# EasyEDA Pro project ProDocument_PCB1_2024-02-11.epro

# Board PCB1
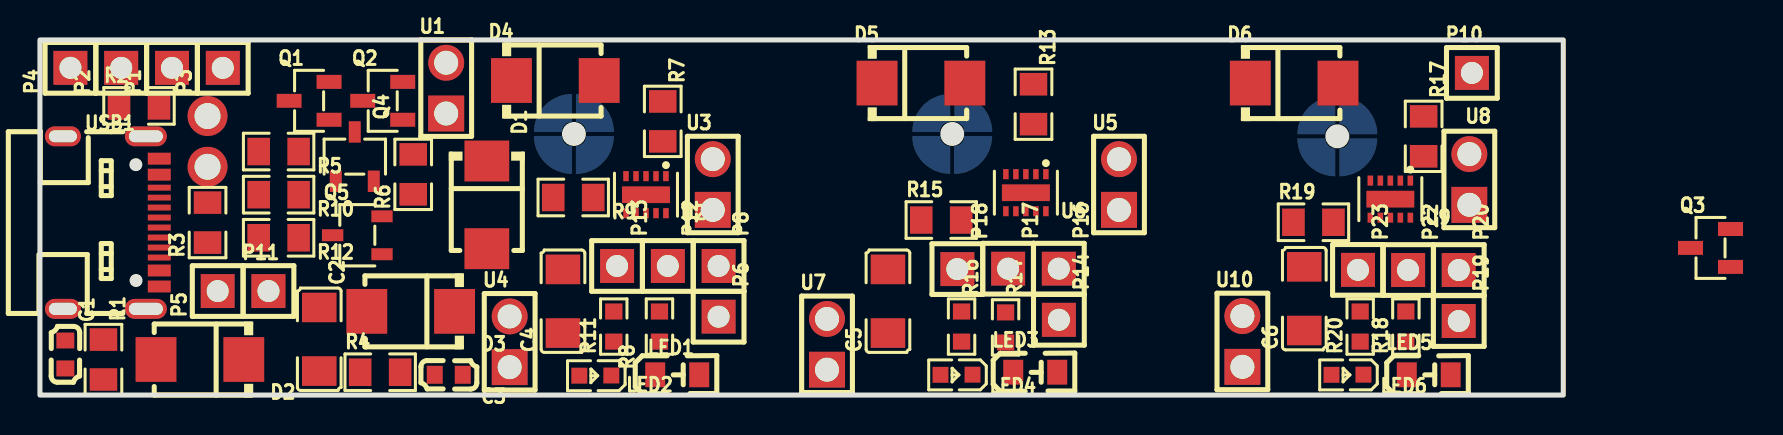
[diagram p0: board, top side]
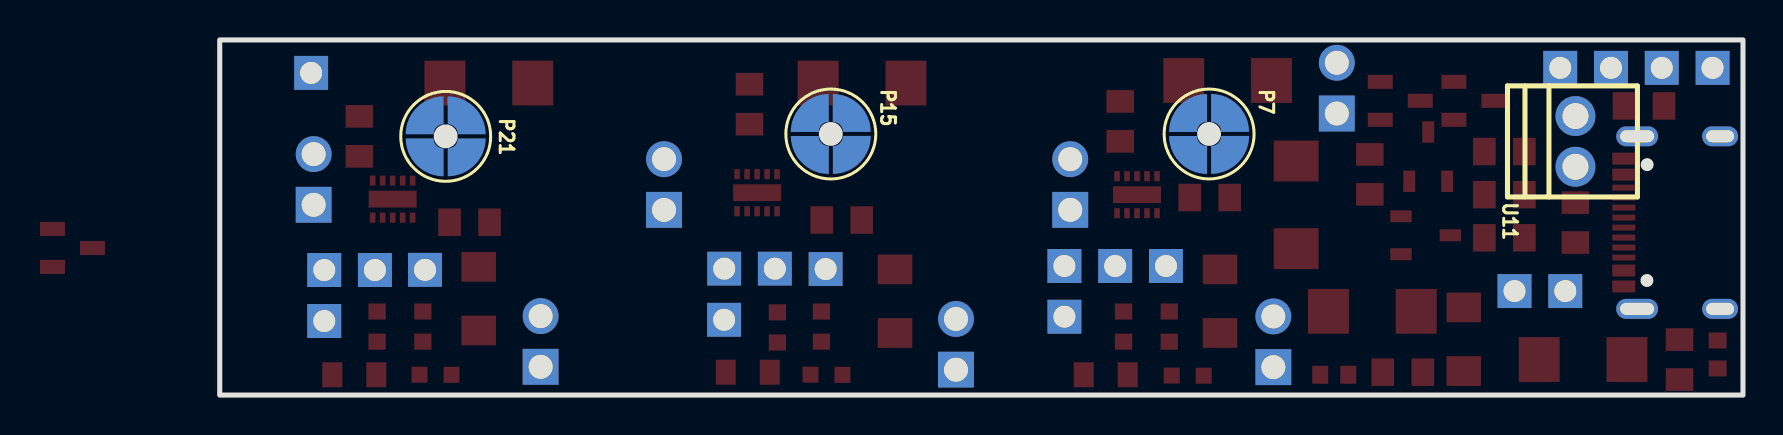
[diagram p1: board, bottom side, seen from below]

Outline 76.2 x 17.78 mm; copper layers: Top Layer, Bottom Layer. Coordinates in mm from the lower left corner of the outline.
Outline path: rectangle 0,17.78 76.2,0
Stack: Top Layer 0.035mm / Dielectric1 1.51mm FR4 er 4.5 / Bottom Layer 0.035mm

## Design rules (mm)
template: JLCPCB Capability(Two Layers Board)
spacing copperThickness1oz (default): track to track 0.102, other pairs 0.152 to 0.3
spacing copperThickness2oz: track to track 0.203, other pairs 0.152 to 0.3
track width copperThickness1oz (default): min 0.127, default 0.254, max 2.54
track width copperThickness2oz: min 0.203, default 0.254, max 2.54
differential pair differentialPair (default): width min 0.127, default 0.254, max 2.54; gap min 0.152, default 0.152
via viaSize (default): diameter min 0.5, default 0.61, max 10; hole min 0.3, default 0.305, max 6.3

## Placement (name value [footprint] x y rotation side)
C1  100nF  [C0603]  1.27 2.03 270 top
C2  1uF  [C1206]  13.97 2.79 270 top
C3  100nF  [C0603]  20.45 1.02 180 top
C4  1uF  [C1206]  26.16 4.7 90 top
C5  1uF  [C1206]  42.42 4.7 90 top
C6  1uF  [C1206]  63.25 4.83 90 top
D1  SMBJ5.0A  [SMB_L4.4-W3.6-LS5.2-RD]  22.35 9.53 270 top
D2  SMBJ5.0A  [SMB_L4.4-W3.6-LS5.2-RD]  8 1.78 180 top
D3  SMBJ5.0A  [SMB_L4.4-W3.6-LS5.2-RD]  18.54 4.19 180 top
D4  SMBJ5.0A  [SMB_L4.4-W3.6-LS5.2-RD]  25.78 15.75 0 top
D5  SMBJ5.0A  [SMB_L4.4-W3.6-LS5.2-RD]  44.07 15.62 0 top
D6  SMBJ5.0A  [SMB_L4.4-W3.6-LS5.2-RD]  62.74 15.62 0 top
LED1  -  [LED0805-RD]  31.88 1.02 0 top
LED2  -  [LED0603-RD]  27.78 0.97 180 top
LED3  -  [LED0805-RD]  49.78 1.14 0 top
LED4  -  [LED0603-RD]  45.85 1.02 180 top
LED5  -  [LED0805-RD]  69.47 1.02 0 top
LED6  -  [LED0603-RD]  65.41 1.02 180 top
P1  2.54-1*1P针  [HDR-TH_1P-P2.54-V-M]  6.6 16.38 90 top
P2  2.54-1*1P针  [HDR-TH_1P-P2.54-V-M]  4.06 16.38 90 top
P3  2.54-1*1P针  [HDR-TH_1P-P2.54-V-M]  9.14 16.38 90 top
P4  2.54-1*1P针  [HDR-TH_1P-P2.54-V-M]  1.52 16.38 90 top
P5  2.54-1*1P针  [HDR-TH_1P-P2.54-V-M]  8.89 5.21 90 top
P6  2.54-1*1P针  [HDR-TH_1P-P2.54-V-M]  33.95 3.92 270 top
P7  BAT_1_+  [SMD_BD4.0-L4.0-W4.0-D1.0]  26.71 13.07 270 bottom
P8  2.54-1*1P针  [HDR-TH_1P-P2.54-V-M]  33.95 6.46 270 top
P10  2.54-1*1P针  [HDR-TH_1P-P2.54-V-M]  71.63 16.13 0 top
P11  2.54-1*1P针  [HDR-TH_1P-P2.54-V-M]  11.43 5.21 0 top
P12  2.54-1*1P针  [HDR-TH_1P-P2.54-V-M]  31.41 6.46 270 top
P13  2.54-1*1P针  [HDR-TH_1P-P2.54-V-M]  28.87 6.46 270 top
P14  2.54-1*1P针  [HDR-TH_1P-P2.54-V-M]  50.97 3.77 270 top
P15  BAT_2_+  [SMD_BD4.0-L4.0-W4.0-D1.0]  45.63 13.07 270 bottom
P16  2.54-1*1P针  [HDR-TH_1P-P2.54-V-M]  50.96 6.33 270 top
P17  2.54-1*1P针  [HDR-TH_1P-P2.54-V-M]  48.43 6.33 270 top
P18  2.54-1*1P针  [HDR-TH_1P-P2.54-V-M]  45.89 6.31 270 top
P19  2.54-1*1P针  [HDR-TH_1P-P2.54-V-M]  70.97 3.71 270 top
P20  2.54-1*1P针  [HDR-TH_1P-P2.54-V-M]  70.97 6.26 270 top
P21  BAT_3_+  [SMD_BD4.0-L4.0-W4.0-D1.0]  64.9 12.95 270 bottom
P22  2.54-1*1P针  [HDR-TH_1P-P2.54-V-M]  68.44 6.26 270 top
P23  2.54-1*1P针  [HDR-TH_1P-P2.54-V-M]  65.93 6.27 270 top
Q1  SI2301  [SOT-23-3_L2.9-W1.3-P1.90-LS2.4-BR]  13.46 14.73 0 top
Q2  SI2301  [SOT-23-3_L2.9-W1.3-P1.90-LS2.4-BR]  17.14 14.73 0 top
Q3  PMOS  [SOT-23-3_L2.9-W1.3-P1.90-LS2.4-BR]  83.57 7.37 0 top
Q4  AO3400A  [SOT-23-3_L2.9-W1.6-P1.90-LS2.8-BR]  15.75 11.94 270 top
Q5  AO3400A  [SOT-23-3_L2.9-W1.6-P1.90-LS2.8-BR]  15.88 8 0 top
R1  100kΩ  [R0805]  3.17 1.78 270 top
R2  5.1kΩ  [R0805]  4.95 14.48 0 top
R3  5.1kΩ  [R0805]  8.38 8.64 90 top
R4  10kΩ  [R0805]  17.02 1.14 0 top
R5  100kΩ  [R0805]  11.94 12.19 180 top
R6  100kΩ  [R0805]  18.67 11.05 90 top
R7  680Ω  [R0805]  31.15 13.7 270 top
R8  430Ω  [R0603]  30.99 3.43 90 top
R9  21.5kΩ  [R0805]  26.68 9.89 180 top
R10  10kΩ  [R0805]  11.94 10.03 180 top
R11  430Ω  [R0603]  28.7 3.43 90 top
R12  10kΩ  [R0805]  11.94 7.87 180 top
R13  680Ω  [R0805]  49.7 14.56 270 top
R14  430Ω  [R0603]  48.3 3.39 270 top
R15  21.5kΩ  [R0805]  45.09 8.76 0 top
R16  430Ω  [R0603]  46.1 3.43 270 top
R17  680Ω  [R0805]  69.22 12.95 270 top
R18  430Ω  [R0603]  68.33 3.43 90 top
R19  21.5kΩ  [R0805]  63.7 8.65 0 top
R20  430Ω  [R0603]  66.04 3.43 90 top
U1  VCCCon  [HDR-TH_2P-P2.54-V-M-2]  20.32 15.37 0 top
U2  BQ24210DQCR  [WSON-10_L3.0-W2.0-P0.50-BL-EP]  30.31 10.03 180 top
U3  DIS-CON-SW  [HDR-TH_2P-P2.54-V-M-2]  33.66 10.54 0 top
U4  NTC1  [HDR-TH_2P-P2.54-V-M-2]  23.5 2.67 0 top
U5  DIS-CON-SW  [HDR-TH_2P-P2.54-V-M-2]  53.97 10.54 0 top
U6  BQ24210DQCR  [WSON-10_L3.0-W2.0-P0.50-BL-EP]  49.32 10.13 180 top
U7  NTC2  [HDR-TH_2P-P2.54-V-M-2]  39.37 2.54 0 top
U8  DIS-CON-SW  [HDR-TH_2P-P2.54-V-M-2]  71.5 10.8 0 top
U9  BQ24210DQCR  [WSON-10_L3.0-W2.0-P0.50-BL-EP]  67.55 9.81 180 top
U10  NTC3  [HDR-TH_2P-P2.54-V-M-2]  60.15 2.68 0 top
U11  SolarCon  [CONN-TH_XY308-2.54-2P]  8.38 12.7 90 bottom
USB1  TYPEC-304-ACP16  [USB-C-SMD_TYPE-C-16P-1]  3.56 8.64 270 top

## Footprints (pads in the part's own frame, mm; a bottom-side part is the same pattern mirrored in y, then rotated)
C0603
  rect 0.8x0.9 smd: 1(-0.7,0) 2(0.7,0)
C1206
  rect 1.485x1.728 smd: 1(-1.593,0) 2(1.593,0)
CONN-TH_XY308-2.54-2P
  round 2 hole 1.3: 1(-1.27,0) 2(1.27,0)
HDR-TH_1P-P2.54-V-M
  rect 1.7x1.7 hole 1.1: 1(0,0)
HDR-TH_2P-P2.54-V-M-2
  rect 1.8x1.8 hole 1.2: 1(0,-1.27)
  round 1.8 hole 1.2: 2(0,1.27)
LED0603-RD
  rect 0.8x0.8 smd: 1(-0.799,-0.004) 2(0.799,0.004)
LED0805-RD
  rect 1x1.25 smd: 1(-1.1,0) 2(1.1,0)
R0603
  rect 0.806x0.864 smd: 1(-0.753,0) 2(0.753,0)
R0805
  rect 1.133x1.377 smd: 1(-1,0) 2(1,0)
SMB_L4.4-W3.6-LS5.2-RD
  rect 2.047x2.241 smd: 1(-2.195,0) 2(2.195,0)
SMD_BD4.0-L4.0-W4.0-D1.0
  custom 1.9x1.9 smd: 1(-1.052,0.921) 1(-0.921,-1.052) 1(0.921,1.052) 1(1.052,-0.921)
SOT-23-3_L2.9-W1.3-P1.90-LS2.4-BR
  rect 1.25x0.7 smd: 1(1,-0.95) 2(1,0.95) 3(-1,0)
SOT-23-3_L2.9-W1.6-P1.90-LS2.8-BR
  rect 1.07x0.6 smd: 1(1.235,-0.95) 2(1.235,0.95) 3(-1.235,0)
USB-C-SMD_TYPE-C-16P-1
  rect 0.6x1.15 smd: A1B12(-3.2,2.41) A4B9(-2.4,2.41) B1A12(3.2,2.41) B4A9(2.4,2.41)
  rect 0.3x1.15 smd: A5(-1.25,2.41) A6(-0.25,2.41) A7(0.25,2.41) A8(1.25,2.41) B5(1.75,2.41) B6(0.75,2.41) B7(-0.75,2.41) B8(-1.75,2.41)
  oval 1x2.1 hole 0.6x1.7: EP(-4.32,1.74) EP(4.32,1.74)
  oval 1x1.8 hole 0.6x1.4: EP(-4.32,-2.41) EP(4.32,-2.41)
WSON-10_L3.0-W2.0-P0.50-BL-EP
  rect 0.28x0.505 smd: 1(-1,-0.927) 2(-0.5,-0.927) 3(0,-0.927) 4(0.5,-0.927) 5(1,-0.927) 6(1,0.927) 7(0.5,0.927) 8(0,0.927) 9(-0.5,0.927) 10(-1,0.927)
  rect 2.4x0.84 smd: 11(0,0)

## Nets
5VUSB: C2.1 C3.2 D1.2 D2.1 D3.2 P5.1 R4.2 R12.2 USB1.A4B9 USB1.B4A9
GND: C1.2 C2.2 C3.1 C4.2 C5.2 C6.2 D2.2 P10.1 P11.1 Q4.2 Q5.2 R1.2 R2.1 R3.2 R4.1 R7.1 R13.1 R17.1 U1.1 U2.3 U4.1 U6.3 U7.1 U9.3 U10.1 U11.1 USB1.A1B12 USB1.B1A12
VBAT1: C4.1 D4.2 LED1.2 LED2.2 P8.1 U2.10 U3.1
VBAT2: C5.1 D5.2 LED3.2 LED4.2 P16.1 U5.1 U6.10
VBAT3: C6.1 D6.2 LED5.2 LED6.2 P20.1 U8.1 U9.10
VCC: D1.1 D4.1 D5.1 D6.1 U1.2
CHRG1: P18.1 R8.2 U2.8 U6.7
CHRG2: P23.1 R14.2 U6.8 U9.7
CHRG3: R18.2 U9.8
D+: P1.1 USB1.A6 USB1.B6
D-: P2.1 USB1.A7 USB1.B7
PGATE: Q1.1 Q2.1 Q4.3 R5.1 R6.1
SBU1: P3.1 USB1.A8
SBU2: P4.1 USB1.B8
VCHG: D3.1 P6.1 P14.1 P19.1 Q2.2 R6.2 U2.1 U6.1 U9.1
VSOLAR: Q1.2 R5.2 R10.2 U11.2
$1N867: LED2.1 R11.1
$1N906: LED1.1 R8.1
$1N1095: R11.2 U2.6
$1N1336: R7.2 U2.2
$1N1382: R9.2 U2.4
$1N1737: P13.1 U2.7
$1N1739: P12.1 U2.9
$1N1977: R3.1 USB1.B5
$1N1993: R2.2 USB1.A5
$1N2563: C1.1 R1.1 USB1.EP
$1N3638: R9.1 U2.5 U4.2
$1N3770: Q1.3 Q2.3
$1N4133: Q4.1 Q5.3 R10.1
$1N4200: Q5.1 R12.1
$1N4528: P7.1 U3.2
$1N5234: LED4.1 R16.1
$1N5236: LED3.1 R14.1
$1N5240: R16.2 U6.6
$1N5246: R13.2 U6.2
$1N5248: R15.2 U6.4
$1N5252: P17.1 U6.9
$1N5260: R15.1 U6.5 U7.2
$1N5275: P15.1 U5.2
$1N5913: LED6.1 R20.1
$1N5915: LED5.1 R18.1
$1N5919: R20.2 U9.6
$1N5925: R17.2 U9.2
$1N5927: R19.2 U9.4
$1N5931: P22.1 U9.9
$1N5939: R19.1 U9.5 U10.2
$1N5954: P21.1 U8.2

Pads without a net: Q3 1 2 3; U2 11; U6 11; U9 11
